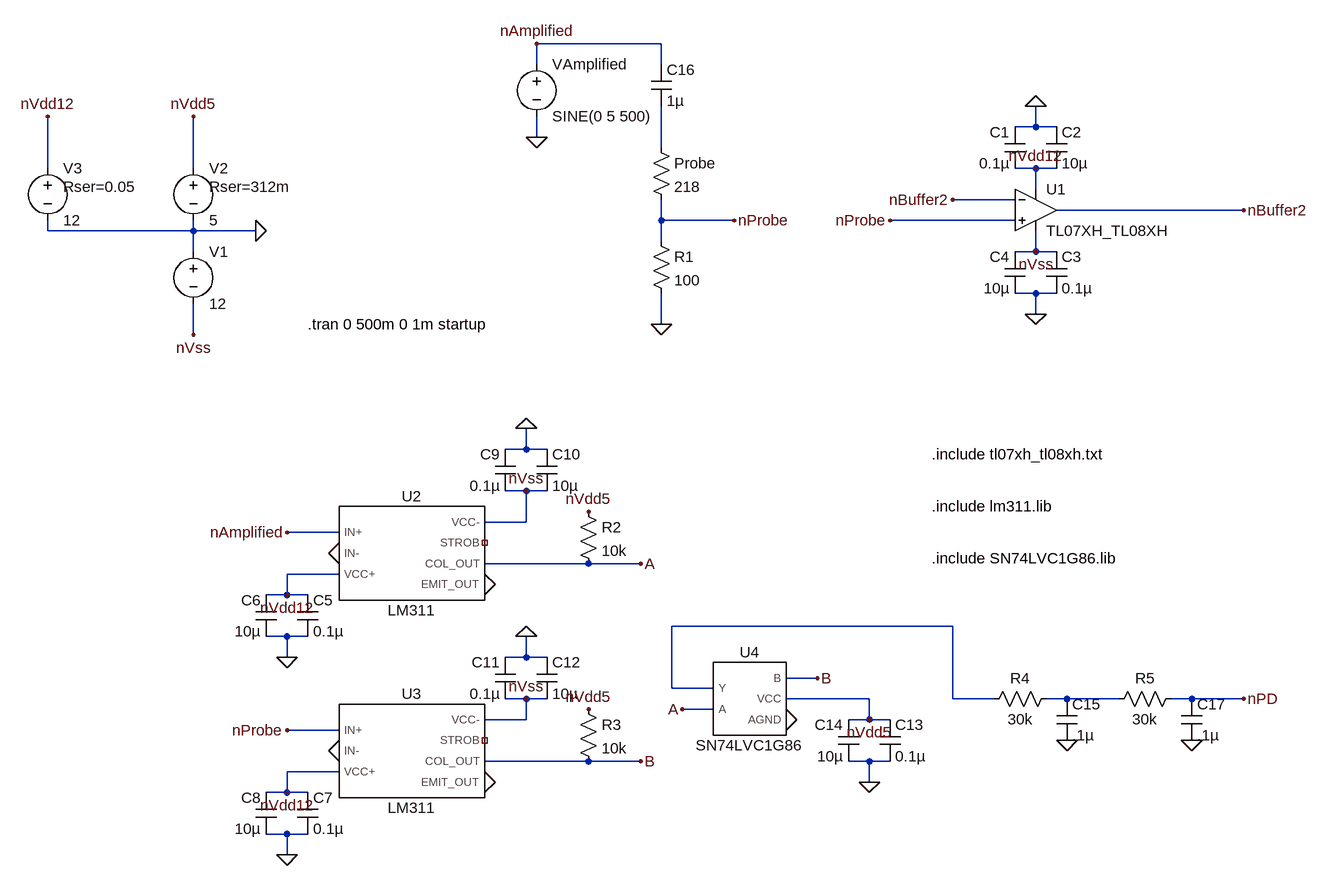
[diagram p0: schematic Stage4Probe_Buffer_and_Phase_Detector.asc]
Stage4Probe_Buffer_and_Phase_Detector.asc, the LTspice schematic file:
Version 4
SHEET 1 1912 1060
WIRE 896 -208 704 -208
WIRE 704 -176 704 -208
WIRE 896 -176 896 -208
WIRE 1472 -80 1472 -112
WIRE 1472 -80 1440 -80
WIRE 1504 -80 1472 -80
WIRE 704 -64 704 -96
WIRE 896 -48 896 -112
WIRE -48 -16 -48 -96
WIRE 176 -16 176 -96
WIRE 1472 -16 1440 -16
WIRE 1504 -16 1472 -16
WIRE 1472 16 1472 -16
WIRE 1440 32 1344 32
WIRE 1792 48 1504 48
WIRE 896 64 896 32
WIRE 1008 64 896 64
WIRE 1440 64 1248 64
WIRE -48 80 -48 64
WIRE 176 80 176 64
WIRE 176 80 -48 80
WIRE 272 80 176 80
WIRE 896 96 896 64
WIRE 176 112 176 80
WIRE 1472 112 1472 80
WIRE 1472 112 1440 112
WIRE 1504 112 1472 112
WIRE 1472 176 1440 176
WIRE 1504 176 1472 176
WIRE 1472 208 1472 176
WIRE 896 224 896 176
WIRE 176 240 176 192
WIRE 688 416 688 384
WIRE 688 416 656 416
WIRE 720 416 688 416
WIRE 688 480 656 480
WIRE 720 480 688 480
WIRE 688 528 688 480
WIRE 688 528 624 528
WIRE 400 544 320 544
WIRE 784 592 624 592
WIRE 864 592 784 592
WIRE 400 608 320 608
WIRE 320 640 320 608
WIRE 320 640 288 640
WIRE 352 640 320 640
WIRE 1344 688 912 688
WIRE 320 704 288 704
WIRE 352 704 320 704
WIRE 320 736 320 704
WIRE 688 736 688 704
WIRE 688 736 656 736
WIRE 720 736 688 736
WIRE 1136 768 1088 768
WIRE 912 784 912 688
WIRE 976 784 912 784
WIRE 688 800 656 800
WIRE 720 800 688 800
WIRE 1216 800 1088 800
WIRE 1344 800 1344 688
WIRE 1408 800 1344 800
WIRE 1520 800 1488 800
WIRE 1600 800 1520 800
WIRE 1712 800 1680 800
WIRE 1792 800 1712 800
WIRE 976 816 928 816
WIRE 688 832 688 800
WIRE 688 832 624 832
WIRE 1216 832 1216 800
WIRE 1216 832 1184 832
WIRE 1248 832 1216 832
WIRE 400 848 320 848
WIRE 784 896 624 896
WIRE 864 896 784 896
WIRE 1216 896 1184 896
WIRE 1248 896 1216 896
WIRE 400 912 320 912
WIRE 1216 928 1216 896
WIRE 320 944 320 912
WIRE 320 944 288 944
WIRE 352 944 320 944
WIRE 320 1008 288 1008
WIRE 352 1008 320 1008
WIRE 320 1040 320 1008
FLAG 272 80 0
FLAG 176 240 nVss
FLAG 176 -96 nVdd5
FLAG -48 -96 nVdd12
FLAG 704 -208 nAmplified
FLAG 896 224 0
FLAG 1008 64 nProbe
FLAG 1472 -16 nVdd12
FLAG 1472 112 nVss
FLAG 1248 64 nProbe
FLAG 1344 32 nBuffer2
FLAG 1792 48 nBuffer2
FLAG 1472 -112 0
FLAG 1472 208 0
FLAG 704 -64 0
FLAG 400 576 0
FLAG 320 640 nVdd12
FLAG 320 736 0
FLAG 320 944 nVdd12
FLAG 320 1040 0
FLAG 400 880 0
FLAG 320 544 nAmplified
FLAG 320 848 nProbe
FLAG 688 480 nVss
FLAG 688 384 0
FLAG 688 800 nVss
FLAG 688 704 0
FLAG 624 624 0
FLAG 624 928 0
FLAG 784 512 nVdd5
FLAG 864 592 A
FLAG 784 816 nVdd5
FLAG 864 896 B
FLAG 1088 832 0
FLAG 1216 832 nVdd5
FLAG 1216 928 0
FLAG 1136 768 B
FLAG 928 816 A
FLAG 1520 864 0
FLAG 1712 864 0
FLAG 1792 800 nPD
SYMBOL voltage 176 96 R0
WINDOW 123 0 0 Left 0
WINDOW 39 0 0 Left 0
SYMATTR InstName V1
SYMATTR Value 12
SYMBOL voltage 176 -32 R0
WINDOW 123 0 0 Left 0
WINDOW 39 24 44 Left 2
SYMATTR SpiceLine Rser=312m
SYMATTR InstName V2
SYMATTR Value 5
SYMBOL voltage -48 -32 R0
WINDOW 123 0 0 Left 0
WINDOW 39 24 44 Left 2
SYMATTR SpiceLine Rser=0.05
SYMATTR InstName V3
SYMATTR Value 12
SYMBOL res 880 80 R0
SYMATTR InstName R1
SYMATTR Value 100
SYMATTR SpiceLine tol=1 pwr=0.5
SYMBOL res 880 -64 R0
SYMATTR InstName Probe
SYMATTR Value 218
SYMBOL OpAmps\\opamp2 1472 -16 R0
SYMATTR InstName U1
SYMATTR Value TL07XH_TL08XH
SYMBOL cap 1456 -16 R180
WINDOW 0 24 56 Left 2
WINDOW 3 24 8 Left 2
SYMATTR InstName C1
SYMATTR Value 0.1µ
SYMATTR SpiceLine V=16 Irms=0.6 Rser=0.05
SYMBOL cap 1488 -80 R0
SYMATTR InstName C2
SYMATTR Value 10µ
SYMATTR SpiceLine V=10 Irms=1.25 Rser=5m
SYMBOL cap 1488 112 R0
SYMATTR InstName C3
SYMATTR Value 0.1µ
SYMATTR SpiceLine V=16 Irms=0.6 Rser=0.05
SYMBOL cap 1456 176 R180
WINDOW 0 24 56 Left 2
WINDOW 3 24 8 Left 2
SYMATTR InstName C4
SYMATTR Value 10µ
SYMATTR SpiceLine V=10 Irms=1.25 Rser=5m
SYMBOL voltage 704 -192 R0
WINDOW 123 0 0 Left 0
WINDOW 39 0 0 Left 0
SYMATTR InstName VAmplified
SYMATTR Value SINE(0 5 500)
SYMBOL LM311 512 576 R0
SYMATTR InstName U2
SYMBOL LM311 512 880 R0
SYMATTR InstName U3
SYMBOL SN74LVC1G86 1024 800 R0
SYMATTR InstName U4
SYMBOL cap 336 640 R0
SYMATTR InstName C5
SYMATTR Value 0.1µ
SYMATTR SpiceLine V=16 Irms=0.6 Rser=0.05
SYMBOL cap 304 704 R180
WINDOW 0 24 56 Left 2
WINDOW 3 24 8 Left 2
SYMATTR InstName C6
SYMATTR Value 10µ
SYMATTR SpiceLine V=10 Irms=1.25 Rser=5m
SYMBOL cap 336 944 R0
SYMATTR InstName C7
SYMATTR Value 0.1µ
SYMATTR SpiceLine V=16 Irms=0.6 Rser=0.05
SYMBOL cap 304 1008 R180
WINDOW 0 24 56 Left 2
WINDOW 3 24 8 Left 2
SYMATTR InstName C8
SYMATTR Value 10µ
SYMATTR SpiceLine V=10 Irms=1.25 Rser=5m
SYMBOL cap 672 480 R180
WINDOW 0 24 56 Left 2
WINDOW 3 24 8 Left 2
SYMATTR InstName C9
SYMATTR Value 0.1µ
SYMATTR SpiceLine V=16 Irms=0.6 Rser=0.05
SYMBOL cap 704 416 R0
SYMATTR InstName C10
SYMATTR Value 10µ
SYMATTR SpiceLine V=10 Irms=1.25 Rser=5m
SYMBOL cap 672 800 R180
WINDOW 0 24 56 Left 2
WINDOW 3 24 8 Left 2
SYMATTR InstName C11
SYMATTR Value 0.1µ
SYMATTR SpiceLine V=16 Irms=0.6 Rser=0.05
SYMBOL cap 704 736 R0
SYMATTR InstName C12
SYMATTR Value 10µ
SYMATTR SpiceLine V=10 Irms=1.25 Rser=5m
SYMBOL res 768 496 R0
SYMATTR InstName R2
SYMATTR Value 10k
SYMBOL res 768 800 R0
SYMATTR InstName R3
SYMATTR Value 10k
SYMBOL cap 1232 832 R0
SYMATTR InstName C13
SYMATTR Value 0.1µ
SYMATTR SpiceLine V=16 Irms=0.6 Rser=0.05
SYMBOL cap 1200 896 R180
WINDOW 0 24 56 Left 2
WINDOW 3 24 8 Left 2
SYMATTR InstName C14
SYMATTR Value 10µ
SYMATTR SpiceLine V=10 Irms=1.25 Rser=5m
SYMBOL res 1504 784 R90
WINDOW 0 0 56 VBottom 2
WINDOW 3 32 56 VTop 2
SYMATTR InstName R4
SYMATTR Value 30k
SYMBOL cap 1504 800 R0
SYMATTR InstName C15
SYMATTR Value .1µ
SYMBOL cap 880 -176 R0
SYMATTR InstName C16
SYMATTR Value 1µ
SYMBOL res 1696 784 R90
WINDOW 0 0 56 VBottom 2
WINDOW 3 32 56 VTop 2
SYMATTR InstName R5
SYMATTR Value 30k
SYMBOL cap 1696 800 R0
SYMATTR InstName C17
SYMATTR Value .1µ
TEXT 352 224 Left 2 !.tran 0 500m 0 1m startup
TEXT 1312 424 Left 2 !.include tl07xh_tl08xh.txt
TEXT 1312 504 Left 2 !.include lm311.lib
TEXT 1312 584 Left 2 !.include SN74LVC1G86.lib

The netlist it stands for:
* Stage4Probe_Buffer_and_Phase_Detector.asc
V1 0 nVss 12
V2 nVdd5 0 5 Rser=312m
V3 nVdd12 0 12 Rser=0.05
R1 nProbe 0 100 tol=1 pwr=0.5
R§Probe N001 nProbe 218
XU1 nProbe nBuffer2 nVdd12 nVss nBuffer2 TL07XH_TL08XH  ; pins In+ In- V+ V- OUT
C1 nVdd12 0 0.1µ V=16 Irms=0.6 Rser=0.05
C2 0 nVdd12 10µ V=10 Irms=1.25 Rser=5m
C3 nVss 0 0.1µ V=16 Irms=0.6 Rser=0.05
C4 0 nVss 10µ V=10 Irms=1.25 Rser=5m
VAmplified nAmplified 0 SINE(0 5 500)
XU2 nAmplified 0 nVdd12 nVss NC_01 A 0 LM311  ; pins IN+ IN- VCC+ VCC- STROB COL_OUT EMIT_OUT
XU3 nProbe 0 nVdd12 nVss NC_02 B 0 LM311  ; pins IN+ IN- VCC+ VCC- STROB COL_OUT EMIT_OUT
XU4 N002 A B nVdd5 0 SN74LVC1G86  ; pins Y A B VCC AGND
C5 nVdd12 0 0.1µ V=16 Irms=0.6 Rser=0.05
C6 0 nVdd12 10µ V=10 Irms=1.25 Rser=5m
C7 nVdd12 0 0.1µ V=16 Irms=0.6 Rser=0.05
C8 0 nVdd12 10µ V=10 Irms=1.25 Rser=5m
C9 nVss 0 0.1µ V=16 Irms=0.6 Rser=0.05
C10 0 nVss 10µ V=10 Irms=1.25 Rser=5m
C11 nVss 0 0.1µ V=16 Irms=0.6 Rser=0.05
C12 0 nVss 10µ V=10 Irms=1.25 Rser=5m
R2 nVdd5 A 10k
R3 nVdd5 B 10k
C13 nVdd5 0 0.1µ V=16 Irms=0.6 Rser=0.05
C14 0 nVdd5 10µ V=10 Irms=1.25 Rser=5m
R4 N003 N002 30k
C15 N003 0 .1µ
C16 nAmplified N001 1µ
R5 nPD N003 30k
C17 nPD 0 .1µ
.tran 0 500m 0 1m startup
.include tl07xh_tl08xh.txt
.include lm311.lib
.include SN74LVC1G86.lib
.lib C:\Users\jason\OneDrive\Documents\GitHub\BowelProbe\LTspiceSim\lm311.lib
.lib C:\Users\jason\OneDrive\Documents\GitHub\BowelProbe\LTspiceSim\SN74LVC1G86.lib
.backanno
.end